# EAGLE design SmartRFv.25.06.15.PS (EAGLE 7.4.0)
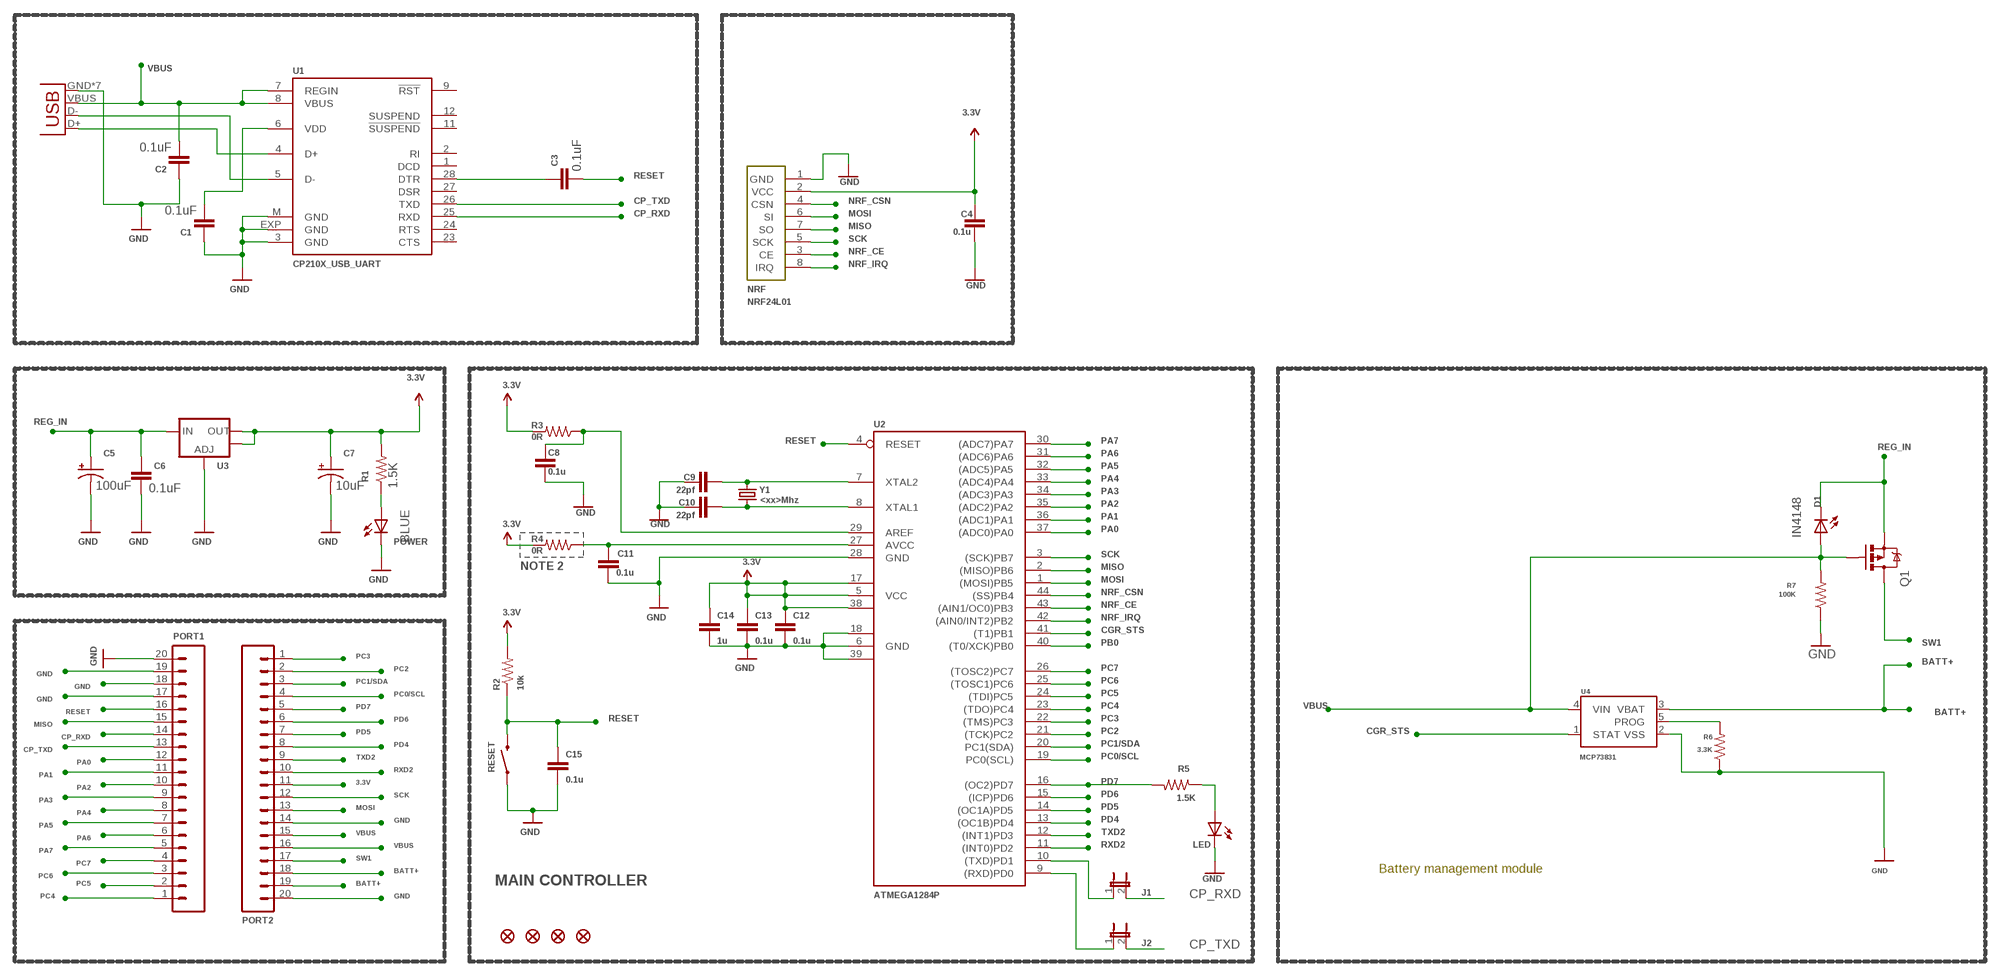
[diagram p0: schematic, sheet 1]

## Parts
C1  0.1uF  CAP0805  [0805]
C2  0.1uF  CAP0805  [0805]
C3  0.1uF  CAP0805  [0805]
C4  0.1u  CAP0805  [0805]
C5  100uF  CAP_POL1206-KIT  [EIA3216-KIT]
C6  0.1uF  CAP0805  [0805]
C7  10uF  CAP_POL1206-KIT  [EIA3216-KIT]
C8  0.1u  CAP0805  [0805]
C9  22pf  CAP0805  [0805]
C10  22pf  CAP0805  [0805]
C11  0.1u  CAP0805  [0805]
C12  0.1u  CAP0805  [0805]
C13  0.1u  CAP0805  [0805]
C14  1u  CAP0805  [0805]
C15  0.1u  CAP0805  [0805]
D1  IN4148  LED1206  [LED-1206]
FID1  FIDUCIAL1X2  [FIDUCIAL-1X2]
FID2  FIDUCIAL1X2  [FIDUCIAL-1X2]
FID3  FIDUCIAL1X2  [FIDUCIAL-1X2]
FID4  FIDUCIAL1X2  [FIDUCIAL-1X2]
J1  JUMPER-2SMD-NC  [SJ_2S]
J2  JUMPER-2SMD-NC  [SJ_2S]
LED  LED  [LED-0805]
NRF  NRF2401  [NRF2401]
PORT1  M20  [1X20]
PORT2  M20  [1X20]
POWER  BLUE  LED  [LED-0805]
Q1  MOSFET-PCHANNELSMD  [SOT23-3]
R1  1.5K  RESISTOR0805-RES  [0805]
R2  10k  RESISTOR0805-RES  [0805]
R3  0R  RESISTOR0805-RES  [0805]
R4  0R  RESISTOR0805-RES  [0805]
R5  1.5K  RESISTOR0805-RES  [0805]
R6  3.3K  RESISTOR0805-RES  [0805]
R7  100K  RESISTOR0805-RES  [0805]
RESET  SWITCH-MOMENTARY-2-SMD-1101NE  [TACTILE-SWITCH-1101NE]
U1  CP210X_USB_UART  [MLP28]
U2  MEGA32-A  [TQFP44]
U3  V_REG_LM1117SOT223  [SOT223]
U4  MCP73831  [SOT23-5]
USB  USB-MICROB  [USB-MICROB]
Y1  <xx>Mhz  CRYSTAL5X3  [CRYSTAL-SMD-5X3]

## Nets
3.3V: C4.2 C7.A(+) C12.1 C13.1 C14.1 NRF.2(VCC) PORT2.11 R1.2 R2.2 R3.2 R4.2 U2.5(VCC) U2.17(VCC1) U2.38(VCC2) U3.2(OUT) U3.4(OUT)
BATT+: PORT2.18 PORT2.19 U4.3(VBAT)
CGR_STS: U2.41((T1)PB1) U4.1(STAT)
CP_RXD: J1.2 PORT1.14 U1.25(RXD)
CP_TXD: J2.2 PORT1.13 U1.26(TXD)
GND: C1.1 C2.1 C4.1 C5.C(-) C6.2 C7.C(-) C8.2 C9.1 C10.1 C11.2 C12.2 C13.2 C14.2 C15.2 LED.2(C) NRF.1(GND) PORT1.17 PORT1.18 PORT1.19 PORT1.20 PORT2.14 PORT2.20 POWER.2(C) R6.1 R7.1 RESET.P$1 U1.3(GND) U1.EXP(GND) U1.M(GND) U2.6(GND) U2.18(GND1) U2.28(GND) U2.39(GND2) U3.1(ADJ) U4.2(VSS) USB.GND USB.MT1(GND) USB.MT2(GND) USB.MT3(GND) USB.MT4(GND) USB.P$1(GND) USB.P$2(GND)
MISO: NRF.7(SO) PORT1.15 U2.2((MISO)PB6)
MOSI: NRF.6(SI) PORT2.13 U2.1((MOSI)PB5)
N$1: C9.2 U2.7(XTAL2) Y1.3
N$2: C10.2 U2.8(XTAL1) Y1.1
N$3: J1.1 U2.10((TXD)PD1)
N$4: C11.1 R4.1 U2.27(AVCC)
N$5: U1.5(D-) USB.D-
N$6: C3.1 U1.28(DTR)
N$7: POWER.1(A) R1.1
N$8: U1.4(D+) USB.D+
N$9: J2.1 U2.9((RXD)PD0)
N$12: C8.1 R3.1 U2.29(AREF)
N$13: LED.1(A) R5.1
N$15: R6.2 U4.5(PROG)
NRF_CE: NRF.3(CE) U2.43((AIN1/OC0)PB3)
NRF_CSN: NRF.4(CSN) U2.44((SS)PB4)
NRF_IRQ: NRF.8(IRQ) U2.42((AIN0/INT2)PB2)
PA0: PORT1.12 U2.37((ADC0)PA0)
PA1: PORT1.11 U2.36((ADC1)PA1)
PA2: PORT1.10 U2.35((ADC2)PA2)
PA3: PORT1.9 U2.34((ADC3)PA3)
PA4: PORT1.8 U2.33((ADC4)PA4)
PA5: PORT1.7 U2.32((ADC5)PA5)
PA6: PORT1.6 U2.31((ADC6)PA6)
PA7: PORT1.5 U2.30((ADC7)PA7)
PB0: U2.40((T0/XCK)PB0)
PC0/SCL: PORT2.4 U2.19(PC0(SCL))
PC1/SDA: PORT2.3 U2.20(PC1(SDA))
PC2: PORT2.2 U2.21((TCK)PC2)
PC3: PORT2.1 U2.22((TMS)PC3)
PC4: PORT1.1 U2.23((TDO)PC4)
PC5: PORT1.2 U2.24((TDI)PC5)
PC6: PORT1.3 U2.25((TOSC1)PC6)
PC7: PORT1.4 U2.26((TOSC2)PC7)
PD4: PORT2.8 U2.13((OC1B)PD4)
PD5: PORT2.7 U2.14((OC1A)PD5)
PD6: PORT2.6 U2.15((ICP)PD6)
PD7: PORT2.5 R5.2 U2.16((OC2)PD7)
REG_IN: C5.A(+) C6.1 D1.C Q1.2(S) U3.3(IN)
RESET: C3.2 C15.1 PORT1.16 R2.1 RESET.P$2 U2.4(RESET)
RXD2: PORT2.10 U2.11((INT0)PD2)
SCK: NRF.5(SCK) PORT2.12 U2.3((SCK)PB7)
SW1: PORT2.17 Q1.3(D)
TXD2: PORT2.9 U2.12((INT1)PD3)
VBUS: C2.2 D1.A PORT2.15 PORT2.16 Q1.1(G) R7.2 U1.7(REGIN) U1.8(VBUS) U4.4(VIN) USB.VBUS
VDD: C1.2 U1.6(VDD)
Unconnected: U1.1(DCD) U1.2(RI) U1.9(!RST) U1.11(!SUSPEND) U1.12(SUSPEND) U1.23(CTS) U1.24(RTS) U1.27(DSR)

## Notes on the sheet
- NOTE 2
- Battery management module
- MAIN CONTROLLER

## Library data of the parts
C1-C3 C6 = SparkFun-Passives:CAP: Capacitor Standard 0603 ceramic capacitor, and 0.1" leaded capacitor.
C4 C8-C15 = SparkFun-Capacitors:CAP: Capacitor Standard 0603 ceramic capacitor, and 0.1" leaded capacitor.
C5 C7 = SparkFun-Passives:CAP_POL: Capacitor Polarized These are standard SMD and PTH capacitors. Normally 10uF, 47uF, and 100uF in electrolytic and tantalum varieties. Always verify the external diameter of the through hole cap, it varies with capacity, voltage, and manufacturer. The EIA devices should be standard.
D1 LED POWER = SparkFun-LED:LED: LEDs Standard schematic elements and footprints for 5mm, 3mm, 1206, and 0603 sized LEDs. 5mm - Spark Fun Electronics SKU : COM-00529 (and others)
FID1-FID4 = SparkFun-Aesthetics:FIDUCIAL: Fiducial Alignment Points Various fiducial points for machine vision alignment.
J1 J2 = SparkFun-Passives:JUMPER-2: Jumper Basic 0.1" spaced jumper. Use with breakaway headers.
NRF = LIBR:NRF2401; MFR_PN: NRF24L01
PORT1 PORT2 = SparkFun-Connectors:M20: 1x20 .1" header This is just like the LOCK variant in that the holes are staggared by 5 mil, but except for the last two holes. They are not altered from the "standard" footprint layout. This is used for a special purpose on the layout of our Graphic LCD Backpack. Make sure you want to use this device before selecting it for you project!
Q1 = SparkFun-DiscreteSemi:MOSFET-PCHANNEL: Generic PMOSFET
R1-R7 = SparkFun-Resistors:RESISTOR: Resistor Basic schematic elements and footprints for 0603, 1206, and PTH resistors.
RESET = SparkFun-Electromechanical:SWITCH-MOMENTARY-2: Various NO switches- pushbuttons, reed, etc
U1 = SparkFun-DigitalIC:CP210X_USB_UART: Single-Chip USB to UART Bridge Source: www.silabs.com .. CP2101.pdf / cp2102.pdf. Spark Fun Electronics SKU : COM-00310
U2 = atmel:MEGA32: MICROCONTROLLER 32 Kbytes FLASH 2 Kbytes SRAM 1 Kbytes EEPROM USART 8-channel 10 bit ADC Source: www.atmel.com .. doc2503.pdf; MPN: ATMEGA1284P; OC_FARNELL: 9171274; OC_NEWARK: 69K6677
U3 = SparkFun-PowerIC:V_REG_LM1117: Voltage Regulator LM1117 Standard adjustable voltage regulator but in SMD form. Spark Fun Electronics SKU : COM-00595
U4 = SparkFun-PowerIC:MCP73831: Miniature single cell, fully integrated Li-Ion, Li-polymer charge management controller http://ww1.microchip.com/downloads/en/DeviceDoc/21984a.pdf IC-09995; PROD_ID: IC-09995
USB = SparkFun-Connectors:USB: USB Connectors USB-B-PTH is fully proven SKU : PRT-00139/CONN-08278 USB-miniB is fully proven SKU : PRT-00587 USB-A-PCB is untested. USB-A-H is throughly reviewed, but untested. Spark Fun Electronics SKU : PRT-00437 USB-B-SMT is throughly reviewed, but untested. Needs silkscreen touching up. USB-A-S has not been used/tested USB-MB-H has not been used/tested USB-MICROB has been used. CONN-09505; PROD_ID: CONN-09505
Y1 = SparkFun-FreqCtrl:CRYSTAL: Various standard crystals. Proven footprints. Spark Fun Electronics SKU : COM-00534

## Board
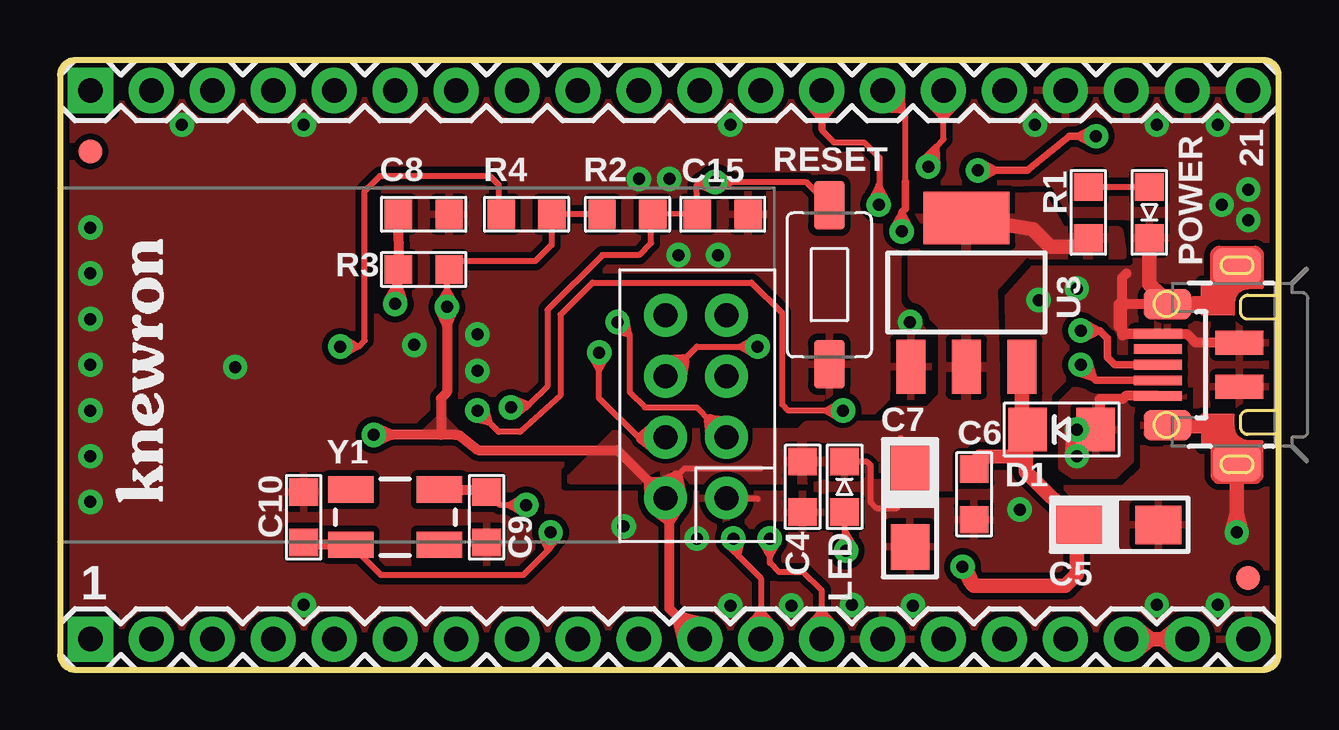
[diagram p1: board, top side]
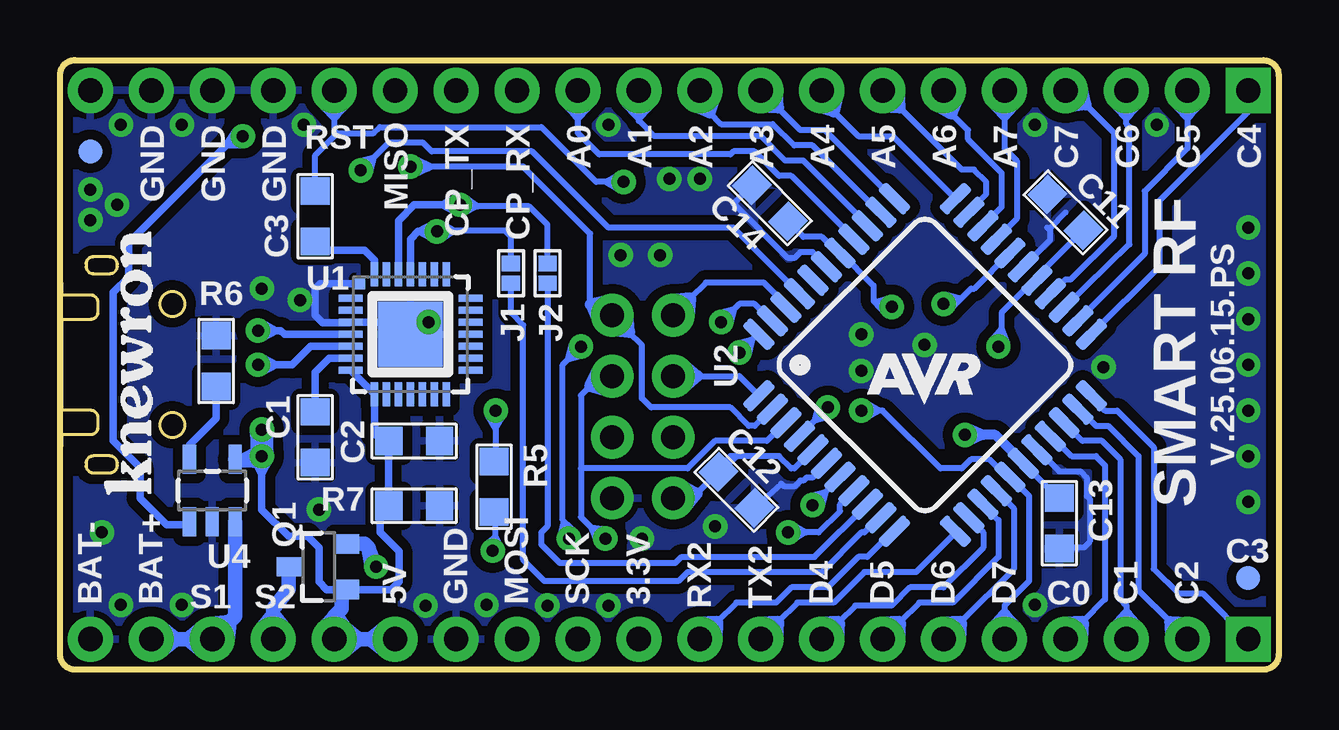
[diagram p2: board, bottom side, seen from below]

Size 50.8 x 25.4 mm. Coordinates in mm from the lower left corner, seen from the top.
Outline: 50.8,0.64 50.8,24.77 arc90 50.16,25.4 0.64,25.39 arc90 0,24.75 0,0.64 arc90 0.64,0 50.16,0 arc90 50.8,0.64
Copper layers (1*16): Top 0.035mm / dielectric 1.5mm / Bottom 0.035mm
Design rules "default *": minimum track width 10mil, minimum drill 18mil, track to track 8mil, track to pad 8mil, pad to pad 0.05mm, via to via 8mil, smd to smd 0mil, copper to edge 5mil, drill to drill 20mil, minimum pad ring 10mil, minimum via ring 8mil, stop-mask expansion 4mil, vias tented up to drill 20mil, thermal gap 10mil

### Footprints (pad centres in the part's own frame; a part is rotated, then mirrored left to right if it is on the bottom)
0805 = smd 1.143 x 1.2: 1 -1.059,0; 2 1.059,0
EIA3216-KIT = smd 1.9 x 1.6: A 1.65,0; C -1.65,0
LED-1206 = smd 1.6 x 1.8: A -1.421,0; C 1.421,0
FIDUCIAL-1X2 = smd 1 x 1: 1 0,0
SJ_2S = smd 0.635 x 0.762: 1 -0.412,0; 2 0.412,0
LED-0805 = smd 1.143 x 1.2: 1 -1.059,0; 2 1.059,0
NRF2401 = drill 1 pad 1.778: 1 0,0; 2 -2.54,0; 3 0,2.54; 4 -2.54,2.54; 5 0,5.08; 6 -2.54,5.08; 7 0,7.62; 8 -2.54,7.62
1X20 = drill 1.016 pad 1.88 square: 1 0,0 | drill 1.016 pad 1.88: 2 2.54,0; 3 5.08,0; 4 7.62,0; 5 10.16,0; 6 12.7,0; 7 15.24,0; 8 17.78,0; 9 20.32,0; 10 22.86,0; 11 25.4,0; 12 27.94,0; 13 30.48,0; 14 33.02,0; 15 35.56,0; 16 38.1,0; 17 40.64,0; 18 43.18,0; 19 45.72,0; 20 48.26,0
SOT23-3 = smd 0.8 x 1.016: 1 -0.95,-1.159; 2 0.95,-1.159; 3 0,1.259
TACTILE-SWITCH-1101NE = smd 2.032 x 1.27: P$1 -3.309,0; P$2 3.309,0
MLP28 = smd 1 x 0.3: 1 -2.5,1.5; 2 -2.5,1; 3 -2.5,0.5; 4 -2.5,0; 5 -2.5,-0.5; 6 -2.5,-1; 7 -2.5,-1.5; 15 2.5,-1.5; 16 2.5,-1; 17 2.5,-0.5; 18 2.5,0; 19 2.5,0.5; 20 2.5,1; 21 2.5,1.5 | smd 0.3 x 1: 8 -1.5,-2.5; 9 -1,-2.5; 10 -0.5,-2.5; 11 0,-2.5; 12 0.5,-2.5; 13 1,-2.5; 14 1.5,-2.5; 22 1.5,2.5; 23 1,2.5; 24 0.5,2.5; 25 0,2.5; 26 -0.5,2.5; 27 -1,2.5; 28 -1.5,2.5 | smd 2.7 x 2.7: EXP 0,0 | smd 0.435 x 0.435: M -2.103,2.103
TQFP44 = smd 1.5 x 0.5: 1 -5.8,4; 2 -5.8,3.2; 3 -5.8,2.4; 4 -5.8,1.6; 5 -5.8,0.8; 6 -5.8,0; 7 -5.8,-0.8; 8 -5.8,-1.6; 9 -5.8,-2.4; 10 -5.8,-3.2; 11 -5.8,-4; 23 5.8,-4; 24 5.8,-3.2; 25 5.8,-2.4; 26 5.8,-1.6; 27 5.8,-0.8; 28 5.8,0; 29 5.8,0.8; 30 5.8,1.6; 31 5.8,2.4; 32 5.8,3.2; 33 5.8,4 | smd 0.5 x 1.5: 12 -4,-5.8; 13 -3.2,-5.8; 14 -2.4,-5.8; 15 -1.6,-5.8; 16 -0.8,-5.8; 17 0,-5.8; 18 0.8,-5.8; 19 1.6,-5.8; 20 2.4,-5.8; 21 3.2,-5.8; 22 4,-5.8; 34 4,5.8; 35 3.2,5.8; 36 2.4,5.8; 37 1.6,5.8; 38 0.8,5.8; 39 0,5.8; 40 -0.8,5.8; 41 -1.6,5.8; 42 -2.4,5.8; 43 -3.2,5.8; 44 -4,5.8
SOT223 = smd 1.219 x 2.235: 1 -2.311,-3.099; 2 0,-3.099; 3 2.311,-3.099 | smd 3.6 x 2.2: 4 0,3.099
SOT23-5 = smd 0.55 x 1.2: 1 -0.95,-1.3; 2 0,-1.3; 3 0.95,-1.3; 4 0.95,1.3; 5 -0.95,1.3
USB-MICROB = smd 0.4 x 2: D+ 0,3.45; D- -0.65,3.45; GND 1.3,3.45; ID 0.65,3.45; VBUS -1.3,3.45 | smd 1.5 x 2: MT1 -4.1,0.15; MT2 4.1,0.15 | smd 1.27 x 1.981: MT3 -2.521,3.05; MT4 2.521,3.05 | smd 1 x 2: P$1 -0.92,0.05; P$2 0.92,0.05
CRYSTAL-SMD-5X3 = smd 1.9 x 1.1: 1 -1.85,-1.15; 2 1.85,-1.15; 3 1.85,1.15; 4 -1.85,1.15

### Placement (x,y rotation side)
C1  40.16,9.68 90 bottom
C2  36.04,9.53 180 bottom
C3  40.16,18.89 90 bottom
C4  30.96,7.62 90 top
C5  44.13,6.03 180 top
C6  38.1,7.3 270 top
C7  35.43,6.76 90 top
C8  15.16,18.97 0 top
C9  17.78,6.35 90 top
C10  10.16,6.35 270 top
C11  8.89,19.05 135 bottom
C12  22.61,7.49 315 bottom
C13  9.14,6.1 270 bottom
C14  21.21,19.43 135 bottom
C15  27.62,18.97 0 top
D1  41.75,10 180 top
FID1  49.53,3.81 0 top
FID2  1.27,21.59 90 top
FID3  49.53,21.59 90 bottom
FID4  1.27,3.81 90 bottom
J1  32,16.51 90 bottom
J2  30.48,16.51 90 bottom
LED  32.7,7.62 90 top
NRF  27.78,7.14 0 top
PORT1  1.27,24.13 0 top
PORT2  1.27,1.27 0 top
POWER  45.4,19.05 270 top
Q1  40.01,4.29 90 bottom
R1  42.86,19.05 270 top
R2  23.65,18.97 180 top
R3  15.16,16.67 0 top
R4  19.45,18.97 0 top
R5  32.7,7.62 90 bottom
R6  44.29,12.86 270 bottom
R7  36.04,6.83 180 bottom
RESET  32.07,16.03 90 top
U1  36.2,13.97 0 bottom
U2  14.74,12.69 45 bottom
U3  37.78,15.72 0 top
U4  44.45,7.46 0 bottom
U$1  [KNEWRON-NAME3]  4.29,6.99 90 top
U$2  [KNEWRON-NAME3]  46.99,7.3 90 bottom
U$3  [AVR-SYMBOL]  17.3,10.95 0 bottom
USB  49.21,12.7 90 top
Y1  13.97,6.35 0 top

### Tracks (layer width: path | path; a pad name or v marks a point on that pad's centre or on a via)
3.3V  (via drill 0.5 pad 1.02)
  Top 0.254: NRF.2 25.24,7.59 25.69,8.04 26.04,8.38 29.21,8.38 | 35.05,9.65 35.05,8.3 C7.A | v16.13,15.11 16.13,15.86 | 16.13,15.86 | 16.13,15.86 16.13,16.63 R3.2 16.52,17.02 19.81,17.02 20.49,17.7 R4.2 R2.2 | 16.13,15.86 | 16.13,15.86 15.8,15.31 | v16.13,15.11 15.8,15.31 | 16.13,15.86 16.46,15.31 | v16.13,15.11 16.46,15.31 | 16.13,15.86 15.8,15.31 | 16.13,15.86 16.46,15.31 | 16.13,15.86 15.8,15.31 | v16.13,15.11 15.8,15.31 | 16.13,15.86 16.46,15.31 | v16.13,15.11 16.46,15.31
  Top 0.406: PORT2.11 25.95,1.99 25.4,2.54 25.4,6.16 | 25.4,6.16 25.4,6.99 NRF.2 | v16.13,15.11 16.13,14.36 | 16.13,14.36 16.13,11.56 15.88,11.3 15.88,9.78 | 24.53,7.85 23.24,9.14 17.43,9.14 16.67,9.75 16.48,9.78 15.88,9.78 | 24.53,7.85 NRF.2 | 15.88,9.78 13.83,9.78 | 13.83,9.78 v13.08,9.78 | 16.13,14.36 16.41,14.99 | v16.13,15.11 16.41,14.99 | 16.13,14.36 15.85,14.99 | v16.13,15.11 15.85,14.99 | 16.13,14.36 16.41,14.99 | 16.13,14.36 15.85,14.99 | 16.13,14.36 16.41,14.99 | v16.13,15.11 16.41,14.99 | 16.13,14.36 15.85,14.99 | v16.13,15.11 15.85,14.99 | 13.83,9.78 13.21,10.06 | v13.08,9.78 13.21,10.06 | 13.83,9.78 13.21,9.5 | v13.08,9.78 13.21,9.5 | 13.83,9.78 13.21,10.06 | 13.83,9.78 13.21,9.5 | 13.83,9.78 13.21,10.06 | v13.08,9.78 13.21,10.06 | 13.83,9.78 13.21,9.5 | v13.08,9.78 13.21,9.5 | 25.4,6.16 25.81,6.76 NRF.2 | 25.4,6.16 24.82,6.6 NRF.2 | 24.53,7.85 24.56,7.12 NRF.2 | 24.53,7.85 25.26,7.83 NRF.2
  Top 0.508: 25.69,8.04 24.98,7.72 NRF.2 25.86,7.28 25.69,8.04
  Top 0.61: U3.4 40.56,18.34 41.27,17.62 42.83,17.62 R1.2
  Top 0.813: 25.95,1.99 26.15,1.15 PORT2.11 26.79,1.79 25.95,1.99
  Bottom 0.254: U2.5 20.19,8.38 20.32,8.38 20.83,8.89 22.58,8.89 | C13.1 9.21,7.16 U2.17 | C14.1 19.81,18.03 19.05,18.03 18.38,17.36 U2.38 18.25,17.36 16.89,16 16.89,15.37 16.85,15.32 | 16.85,15.32 16.64,15.11 v16.13,15.11 | 22.58,8.89 C12.1 23.38,8.24 | 22.58,8.89 22.86,8.89 23.24,8.51 23.24,8.38 23.5,8.13 23.5,8.1 24.26,7.33 24.45,7.14 NRF.2 | 16.85,15.32 | 16.85,15.32 16.22,15.48 | v16.13,15.11 16.22,15.48 | 16.85,15.32 | 16.85,15.32 16.41,14.85 | v16.13,15.11 16.41,14.85 | 16.85,15.32 16.22,15.48 | 16.22,15.48 | v16.13,15.11 16.22,15.48 | 16.85,15.32 16.41,14.85 | v16.13,15.11 16.41,14.85 | 16.85,15.32 16.22,15.48 | v16.13,15.11 16.22,15.48 | 16.85,15.32 16.41,14.85 | v16.13,15.11 16.41,14.85
  Bottom 0.406: U2.17 10.64,8.61 11.81,9.78 12.33,9.78 | 12.33,9.78 v13.08,9.78 | 12.33,9.78 12.96,9.5 | v13.08,9.78 12.96,9.5 | 12.33,9.78 12.96,10.06 | v13.08,9.78 12.96,10.06 | 12.33,9.78 12.96,9.5 | 12.33,9.78 12.96,10.06 | 12.33,9.78 12.96,9.5 | v13.08,9.78 12.96,9.5 | 12.33,9.78 12.96,10.06 | v13.08,9.78 12.96,10.06
  Bottom 0.508: 24.26,7.33 24.75,6.74 NRF.2 24.94,7.7 24.26,7.33
  pour Top (isolate 0.305): 35.56,19.68 40.32,19.68 40.16,19.53 40.32,17.46 38.89,15.88 39.05,8.89 37.78,7.62 34.92,7.62 34.29,8.26 34.29,10.16 34.92,10.79 36.2,10.79 36.83,11.43 36.83,14.29 35.56,15.56
  pour Top: 34.29,10.16 31.11,10.16 30.8,9.84 23.18,9.84 21.27,7.94 33.34,7.94 33.66,7.62 34.92,7.62 34.29,8.26
  pour Top: 40.48,17.3 44.29,17.3 44.13,18.26 41.75,18.26 40.96,19.68 40.48,19.68
  pour Top: 15.88,10.48 15.24,9.84 16.51,9.84
BATT+
  Top 0.61: PORT2.18 45.47,1.27 | 45.47,1.27 45.97,1.27 | 45.97,1.27 PORT2.19 | 45.97,1.27 46.59,0.77 PORT2.19 | 45.97,1.27 46.59,1.77 PORT2.19 | 45.47,1.27 44.85,1.77 PORT2.18 | 45.47,1.27 44.85,0.77 PORT2.18
  Bottom 0.61: U4.3 43.5,2.22 43.73,1.99 | 43.73,1.99 PORT2.18 | 44.29,1.27 PORT2.18 | PORT2.18 45.47,1.27 | 45.47,1.27 45.97,1.27 | 45.97,1.27 PORT2.19 | 45.97,1.27 46.59,0.77 PORT2.19 | 45.97,1.27 46.59,1.77 PORT2.19 | 43.73,1.99 43.82,1.2 PORT2.18 | 43.73,1.99 44.52,1.9 PORT2.18 | 45.47,1.27 44.85,1.77 PORT2.18 | 45.47,1.27 44.85,0.77 PORT2.18
CGR_STS  (via drill 0.5 pad 1.02)
  Top 0.305: 42.43,22.23 42.07,22.23 40.32,20.8 39.01,20.8 | 42.43,22.23 v43.18,22.23 | 39.01,20.8 | 39.01,20.8 v38.26,20.8 | 39.01,20.8 38.43,21.11 | 39.01,20.8 38.43,20.48 | 38.43,21.11 | 38.43,20.48 | 42.43,22.23 | 42.43,22.23 43.01,21.91 | 42.43,22.23 43.01,22.54 | 39.01,20.8 38.43,21.11 | 39.01,20.8 | 39.01,20.8 38.43,21.11 | v38.26,20.8 38.43,21.11 | 39.01,20.8 | 39.01,20.8 38.43,20.48 | v38.26,20.8 38.43,20.48 | 39.01,20.8 38.43,21.11 | v38.26,20.8 38.43,21.11 | 39.01,20.8 38.43,20.48 | v38.26,20.8 38.43,20.48 | 42.43,22.23 | 42.43,22.23 | 42.43,22.23 43.01,21.91 | 43.01,21.91 | v43.18,22.23 43.01,21.91 | 42.43,22.23 43.01,22.54 | 43.01,22.54 | v43.18,22.23 43.01,22.54 | 42.43,22.23 43.01,21.91 | 42.43,22.23 43.01,22.54 | 42.43,22.23 43.01,21.91 | v43.18,22.23 43.01,21.91 | 42.43,22.23 43.01,22.54 | v43.18,22.23 43.01,22.54
  Bottom 0.254: U2.41 22.73,18.41 27.94,18.41 31.11,21.59 35.31,21.59 35.69,21.97 37.08,21.97 37.73,21.33 | 37.73,21.33 v38.26,20.8 | 37.73,21.33 37.89,20.7 v38.26,20.8 | 37.73,21.33 38.35,21.16 v38.26,20.8
  Bottom 0.305: v43.18,22.23 43.5,22.23 43.84,21.88 | 43.84,21.88 47.94,17.78 47.94,16.35 48.58,15.72 48.58,9.53 47.47,8.41 47.47,7.14 46.35,6.03 45.53,6.03 U4.1 | 43.84,21.88 43.47,22.42 v43.18,22.23 | 43.84,21.88 43.18,21.87 v43.18,22.23
CP_RXD  (via drill 0.5 pad 1.02)
  Top 0.254: 35.24,20.32 35.24,23.18 35.01,23.41 PORT1.14
  Top 0.305: 35.24,20.32 35.24,19.21 35.08,19.05 35.08,19.01 | 35.08,19.01 v35.08,18.26 | v35.08,18.26 35.4,18.09 | v35.08,18.26 34.77,18.09 | 35.08,19.01 | 35.08,19.01 34.77,18.43 | 35.08,19.01 35.4,18.43 | 35.08,19.01 | 35.08,19.01 | 35.08,19.01 34.77,18.43 | 34.77,18.43 | v35.08,18.26 34.77,18.43 | 35.08,19.01 35.4,18.43 | 35.4,18.43 | v35.08,18.26 35.4,18.43 | 35.08,19.01 34.77,18.43 | 35.08,19.01 35.4,18.43 | 35.08,19.01 34.77,18.43 | v35.08,18.26 34.77,18.43 | 35.08,19.01 35.4,18.43 | v35.08,18.26 35.4,18.43
  Top 0.508: 35.01,23.41 34.98,24.16 PORT1.14 34.26,23.45 35.01,23.41
  Bottom 0.254: J1.2 32,18.03 32.26,18.29 34.33,18.29 | 34.33,18.29 35.05,18.29 v35.08,18.26 | 34.33,18.29 34.88,17.94 v35.08,18.26 | 34.33,18.29 34.9,18.59 v35.08,18.26
  Bottom 0.305: U1.25 36.2,17.94 35.88,18.26 35.83,18.26 | 35.83,18.26 | 35.83,18.26 v35.08,18.26 | 35.83,18.26 35.25,18.57 | 35.83,18.26 35.25,17.94 | 35.25,18.57 | 35.25,17.94 | 35.83,18.26 35.25,18.57 | 35.83,18.26 | 35.83,18.26 35.25,18.57 | v35.08,18.26 35.25,18.57 | 35.83,18.26 | 35.83,18.26 35.25,17.94 | v35.08,18.26 35.25,17.94 | 35.83,18.26 35.25,18.57 | v35.08,18.26 35.25,18.57 | 35.83,18.26 35.25,17.94 | v35.08,18.26 35.25,17.94
CP_TXD  (via drill 0.5 pad 1.02)
  Top 0.254: 31.75,22.54 31.75,22.48 32.26,21.97 33.53,21.97 34.16,21.34 34.16,20.19 34.13,20.16
  Top 0.305: PORT1.13 31.75,23.11 31.75,22.54 | 34.13,20.16 34.13,20.12 | 34.13,20.12 v34.13,19.37 | v34.13,19.37 34.4,19.14 | v34.13,19.37 33.79,19.27 | 34.13,20.12 | 34.13,20.12 33.82,19.54 | 34.13,20.12 34.44,19.54 | 34.13,20.12 | 34.13,20.12 | 34.13,20.12 33.82,19.54 | 33.82,19.54 | v34.13,19.37 33.82,19.54 | 34.13,20.12 34.44,19.54 | 34.44,19.54 | v34.13,19.37 34.44,19.54 | 34.13,20.12 33.82,19.54 | 34.13,20.12 34.44,19.54 | 34.13,20.12 33.82,19.54 | v34.13,19.37 33.82,19.54 | 34.13,20.12 34.44,19.54 | v34.13,19.37 34.44,19.54
  Top 0.61: 31.75,23.11 32.25,23.73 PORT1.13 31.25,23.73 31.75,23.11
  Bottom 0.254: J2.2 30.48,18.54 31.24,19.3 33.38,19.3 | 33.38,19.3 34.07,19.3 v34.13,19.37 | 33.38,19.3 33.97,19.02 v34.13,19.37 | 33.38,19.3 33.91,19.68 v34.13,19.37
  Bottom 0.305: U1.26 36.7,18.71 36.04,19.37 34.88,19.37 | v34.13,19.37 34.88,19.37 | 34.88,19.37 | 34.88,19.37 34.3,19.68 | 34.88,19.37 34.3,19.05 | 34.3,19.68 | 34.3,19.05 | 34.88,19.37 34.3,19.68 | 34.88,19.37 | 34.88,19.37 34.3,19.68 | v34.13,19.37 34.3,19.68 | 34.88,19.37 | 34.88,19.37 34.3,19.05 | v34.13,19.37 34.3,19.05 | 34.88,19.37 34.3,19.68 | v34.13,19.37 34.3,19.68 | 34.88,19.37 34.3,19.05 | v34.13,19.37 34.3,19.05
GND  (via drill 0.5 pad 1.02)
  Top 0.254: 29.08,7.11 27.81,7.11 NRF.1 | LED.2 33.61,8.68 33.78,8.51 33.78,6.99 34.04,6.73 34.88,6.73 R7.1
  Top 0.406: USB.GND 44.42,14 44.13,14.29 44.13,15.24 45.4,15.24 45.81,15.65 | USB.P$2 47.34,13.62 46.99,13.97 44.34,13.97 R6.1 44.29,16.35 44.45,16.51
  Top 0.61: USB.MT2 48.9,16.63 48.9,15.88 48.32,15.3 USB.MT4 45.81,15.65 45.4,16.06 POWER.2 | v49.05,5.71 49.05,6.46 | 49.05,6.46 | 49.05,6.46 USB.MT1 48.42,9.24 48.42,9.84 48.16,10.1 USB.MT3 | 49.05,6.46 49.25,5.77 | 48.86,5.77 | 48.86,5.77 | 49.05,6.46 48.86,5.77 | 48.86,5.77 | v49.05,5.71 48.86,5.77 | 49.05,6.46 49.25,5.77 | 49.25,5.77 | 49.25,5.77 | 49.05,6.46 49.25,5.77 | 49.05,6.46 48.86,5.77 | 48.86,5.77 | 49.05,6.46 | 49.05,6.46 48.86,5.77 | 48.86,5.77 | v49.05,5.71 48.86,5.77 | 49.05,6.46 49.25,5.77 | 49.25,5.77 | v49.05,5.71 49.25,5.77 | 49.05,6.46 48.86,5.77 | v49.05,5.71 48.86,5.77 | 49.05,6.46 49.25,5.77 | 49.25,5.77 | 49.05,6.46 48.86,5.77 | v49.05,5.71 48.86,5.77 | 49.05,6.46 49.25,5.77 | v49.05,5.71 49.25,5.77
  Bottom 0.254: U2.18 10.04,9.16 9.14,8.26 8.26,8.26 8,8 8,7.24 7.87,7.11 7.87,5.33 8.13,5.08 9.1,5.08 C13.2 | 8.89,19.05 | C12.2 20.73,7.75 20.6,7.62 20.19,7.62 19.94,7.87 19.81,7.87 19.68,8 19.43,8 U2.6 | U2.28 9.53,17.91 9.53,18.29 9.65,18.41 9.53,18.41 8.89,19.05 | U2.39 18.85,16.81 19.43,17.4 19.94,17.4 20.19,17.14 20.45,17.14 22.73,19.43 22.71,19.43 C14.2
  Bottom 0.305: 36.83,13.97 37.33,14.47 U1.3 38.72,14.45 39.85,14.45 40.16,14.76 40.16,15.88 39.97,16.07 U1.M
  other vias: 33.02,2.7 49.53,20 49.53,18.73 40.64,22.7 48.42,19.37 40.8,15.4 42.39,15.88 45.72,22.7 48.26,22.7 40.01,6.67 45.72,2.7 48.26,2.7 10.16,22.7 10.16,2.7 14.76,13.53 17.4,13.97 17.4,12.45 24.13,20.45 25.4,20.45 35.43,14.48 25.78,17.27 27.43,17.27 27.94,2.67 23.5,5.97 26.54,5.46 1.27,8.89 1.27,10.79 1.27,12.7 1.27,14.61 1.27,6.99 1.27,16.51 1.27,18.41 30.48,2.67 35.56,2.67 5.08,22.7 27.94,22.7 7.3,12.6
  pour Bottom (isolate 0.406, rank 3): -1.91,27.3 52.07,27.3 52.07,-1.27 -1.91,-1.27
  pour Top (isolate 0.254, rank 3): -1.27,26.35 51.44,26.35 51.44,-0.32 -1.27,-0.32
MISO  (via drill 0.5 pad 1.02)
  Top 0.254: 36.41,21.68 36.2,21.46 v36.2,20.95 | 36.41,21.68 36.52,21.79 | 36.52,21.79 36.83,22.1 36.83,23.11 PORT1.15 | 36.52,21.79 36.4,21.68 | 36.4,21.68 35.93,21.23 | v36.2,20.95 35.93,21.23 | 36.52,21.79 36.58,20.98 | 36.41,21.68 35.94,21.23 v36.2,20.95 | 36.41,21.68 36.56,21.05 v36.2,20.95 | 36.4,21.68 35.93,21.23 | v36.2,20.95 35.93,21.23 | 36.4,21.68 36.56,21.05 v36.2,20.95 | v36.2,20.95 35.99,21.28 36.53,21.62 36.58,20.98 | v36.2,20.95 36.58,20.98
  Top 0.508: 36.83,23.11 37.34,23.67 PORT1.15 36.32,23.67 36.83,23.11
  Bottom 0.254: U2.2 21.15,10.85 21.84,10.16 22.1,10.16 22.86,10.92 26.16,10.92 26.54,11.3 26.54,13.53 27.07,14.06 NRF.7 28.23,14.76 28.68,15.21 28.7,15.24 28.7,18.16 31.5,20.95 35.3,20.95 | 35.3,20.95 35.45,20.95 | 35.45,20.95 v36.2,20.95 | 35.3,20.95 36.03,20.61 | v36.2,20.95 36.03,20.61 | 35.3,20.95 36.03,21.3 | v36.2,20.95 36.03,21.3 | 35.45,20.95 36,20.63 v36.2,20.95 | 35.45,20.95 36,21.28 v36.2,20.95 | 36.03,20.61 35.45,20.88 35.97,21.26 v36.2,20.95 | v36.2,20.95 36.03,20.61 | v36.2,20.95 35.97,20.65 35.45,21.03 36.03,21.3 | v36.2,20.95 36.03,21.3
  Bottom 0.508: NRF.7 27.84,14.13 27.07,14.06 27.15,14.82 NRF.7 | NRF.7 27.92,15.38 28.68,15.21 28.36,14.51 NRF.7
MOSI  (via drill 0.5 pad 1.02)
  Top 0.254: PORT2.13 31.75,2.29 31.75,3.3 30.99,4.06 29.97,4.06 29.59,4.45 29.59,4.71 | 29.59,4.71 v29.59,5.46 | NRF.6 25.3,12.22 25.98,12.9 26.54,13.46 28.33,13.46 | 28.33,13.46 | 28.33,13.46 v29.08,13.46 | 29.59,4.71 29.89,5.32 v29.59,5.46 | 29.59,4.71 | 29.59,4.71 29.3,5.32 v29.59,5.46 | 28.33,13.46 | 28.33,13.46 28.89,13.13 | v29.08,13.46 28.89,13.13 | 28.33,13.46 28.89,13.79 | v29.08,13.46 28.89,13.79 | 28.33,13.46 28.89,13.13 | 28.33,13.46 28.89,13.79 | 28.33,13.46 28.89,13.13 | v29.08,13.46 28.89,13.13 | 28.33,13.46 28.89,13.79 | v29.08,13.46 28.89,13.79 | 29.59,4.71 29.92,5.27 | v29.59,5.46 29.92,5.27 | 29.59,4.71 | 29.59,4.71 29.26,5.27 | v29.59,5.46 29.26,5.27 | 29.59,4.71 29.92,5.27 | 29.59,4.71 29.26,5.27 | 29.59,4.71 29.92,5.27 | v29.59,5.46 29.92,5.27 | 29.59,4.71 29.26,5.27 | v29.59,5.46 29.26,5.27
  Top 0.508: 25.98,12.9 25.21,12.86 NRF.6 25.87,12.13 25.98,12.9 | 31.75,2.29 31.24,1.73 PORT2.13 32.26,1.73 31.75,2.29
  Bottom 0.254: NRF.6 24.24,12.22 22.48,12.22 U2.1 | 29.61,12.93 29.84,12.7 29.84,6.22 29.8,6.18 | 29.61,12.93 v29.08,13.46 | v29.59,5.46 29.59,5.97 29.8,6.18 | 29.8,6.18 29.35,5.68 v29.59,5.46 | 29.8,6.18 29.91,5.51 v29.59,5.46 | 29.61,12.93 29.45,13.56 v29.08,13.46 | 29.61,12.93 28.99,13.09 v29.08,13.46 | 29.8,6.18 29.33,5.74 | v29.59,5.46 29.33,5.74 | 29.8,6.18 | 29.8,6.18 29.96,5.55 | v29.59,5.46 29.96,5.55 | 29.8,6.18 29.33,5.74 | v29.59,5.46 29.33,5.74 | 29.8,6.18 29.96,5.55 | v29.59,5.46 29.96,5.55
  Bottom 0.508: 24.24,12.22 24.84,11.73 NRF.6 24.84,12.71 24.24,12.22
N$1  (via drill 0.5 pad 1.02)
  Top 0.254: v19.43,6.86 18.68,6.86 | 18.68,6.86 | 18.68,6.86 18.33,6.86 C9.2 | 18.68,6.86 | 18.68,6.86 19.24,6.53 | v19.43,6.86 19.24,6.53 | 18.68,6.86 19.24,7.19 | v19.43,6.86 19.24,7.19 | 18.68,6.86 19.24,6.53 | 18.68,6.86 19.24,7.19 | 18.68,6.86 19.24,6.53 | v19.43,6.86 19.24,6.53 | 18.68,6.86 19.24,7.19 | v19.43,6.86 19.24,7.19
  Top 0.406: Y1.3 17.78,7.5 C9.2
  Bottom 0.254: U2.7 18.28,8.01 18.9,7.39 | 18.9,7.39 v19.43,6.86 | 18.9,7.39 19.06,6.76 v19.43,6.86 | 18.9,7.39 19.53,7.23 v19.43,6.86
N$2  (via drill 0.5 pad 1.02)
  Top 0.254: 20.34,4.97 20.45,5.08 v20.45,5.71 | 20.34,4.97 19.3,3.94 13.38,3.94 Y1.1 | 20.34,4.97 20.74,5.48 v20.45,5.71 | 20.34,4.97 20.09,5.57 v20.45,5.71
  Top 0.406: Y1.1 10.16,5.2 C10.2
  Bottom 0.254: 17.71,7.43 U2.8 18.29,6.89 18.29,6.6 19.18,5.71 19.7,5.71 | 19.7,5.71 | 19.7,5.71 v20.45,5.71 | 19.7,5.71 | 19.7,5.71 20.25,5.39 | v20.45,5.71 20.25,5.39 | 19.7,5.71 20.25,6.04 | v20.45,5.71 20.25,6.04 | 19.7,5.71 20.25,5.39 | 19.7,5.71 20.25,6.04 | 19.7,5.71 20.25,5.39 | v20.45,5.71 20.25,5.39 | 19.7,5.71 20.25,6.04 | v20.45,5.71 20.25,6.04
N$3
  Bottom 0.254: U2.10 16.58,6.28 16.71,6.28 17.27,5.71 17.4,5.71 19.05,4.06 24.64,4.06 25.02,3.68 30.61,3.68 31.5,4.57 31.5,14.35 32,14.86 J1.1
N$4  (via drill 0.5 pad 1.02)
  Top 0.254: v11.68,13.46 12.43,13.46 | 12.43,13.46 | 12.43,13.46 12.45,13.46 12.7,13.72 12.7,19.94 13.34,20.57 17.91,20.57 18.29,20.19 18.29,19.04 R4.1 | 12.43,13.46 11.88,13.79 | v11.68,13.46 11.88,13.79 | 12.43,13.46 | 12.43,13.46 11.88,13.13 | v11.68,13.46 11.88,13.13 | 12.43,13.46 11.88,13.79 | 12.43,13.46 11.88,13.13 | 12.43,13.46 11.88,13.79 | v11.68,13.46 11.88,13.79 | 12.43,13.46 11.88,13.13 | v11.68,13.46 11.88,13.13
  Bottom 0.254: U2.27 10.08,16.34 | C11.1 10.08,16.36 10.08,16.34 | 10.08,16.34 11.56,14.86 11.56,14.2 | 11.56,14.2 11.56,13.59 v11.68,13.46 | 11.56,14.2 11.33,13.6 v11.68,13.46 | 11.56,14.2 11.97,13.71 v11.68,13.46
N$5  (via drill 0.5 pad 1.02)
  Top 0.254: 45.75,12.06 USB.D-
  Top 0.305: 45.75,12.06 43.18,12.06 43.08,12.17 | 43.08,12.17 v42.55,12.7 | 43.08,12.17 42.89,12.8 v42.55,12.7 | 43.08,12.17 42.44,12.36 v42.55,12.7
  Bottom 0.305: U1.5 40.35,13.47 41.12,12.7 41.8,12.7 | 41.8,12.7 v42.55,12.7 | 41.8,12.7 | 41.8,12.7 42.38,12.39 | 41.8,12.7 42.38,13.01 | 41.8,12.7 | 41.8,12.7 | 41.8,12.7 42.38,12.39 | 42.38,12.39 | v42.55,12.7 42.38,12.39 | 41.8,12.7 42.38,13.01 | 42.38,13.01 | v42.55,12.7 42.38,13.01 | 41.8,12.7 42.38,12.39 | 41.8,12.7 42.38,13.01 | 41.8,12.7 42.38,12.39 | v42.55,12.7 42.38,12.39 | 41.8,12.7 42.38,13.01 | v42.55,12.7 42.38,13.01
N$6
  Bottom 0.305: U1.28 37.7,17.06 38.1,17.46 40.13,17.46 C3.1
N$7
  Top 0.254: R1.1 POWER.1
N$8  (via drill 0.5 pad 1.02)
  Top 0.305: USB.D+ 43.97,12.7 43.66,13.02 43.66,13.81 43.34,14.13 43.3,14.13 | 43.3,14.13 | 43.3,14.13 v42.55,14.13 | 43.3,14.13 42.71,14.44 | 43.3,14.13 42.71,13.82 | 42.71,14.44 | 42.71,13.82 | 43.3,14.13 42.71,14.44 | 43.3,14.13 | 43.3,14.13 42.71,14.44 | v42.55,14.13 42.71,14.44 | 43.3,14.13 | 43.3,14.13 42.71,13.82 | v42.55,14.13 42.71,13.82 | 43.3,14.13 42.71,14.44 | v42.55,14.13 42.71,14.44 | 43.3,14.13 42.71,13.82 | v42.55,14.13 42.71,13.82
  Bottom 0.305: U1.4 41.43,13.97 41.59,14.13 41.8,14.13 | 41.8,14.13 v42.55,14.13 | 41.8,14.13 | 41.8,14.13 42.38,13.82 | 41.8,14.13 42.38,14.44 | 41.8,14.13 | 41.8,14.13 | 41.8,14.13 42.38,13.82 | 42.38,13.82 | v42.55,14.13 42.38,13.82 | 41.8,14.13 42.38,14.44 | 42.38,14.44 | v42.55,14.13 42.38,14.44 | 41.8,14.13 42.38,13.82 | 41.8,14.13 42.38,14.44 | 41.8,14.13 42.38,13.82 | v42.55,14.13 42.38,13.82 | 41.8,14.13 42.38,14.44 | v42.55,14.13 42.38,14.44
N$9
  Bottom 0.254: J2.1 30.48,5.97 30.73,5.71 30.73,5.21 29.97,4.45 25.15,4.45 24.89,4.7 19.34,4.7 U2.9
N$12  (via drill 0.5 pad 1.02)
  Top 0.406: C8.1 14.12,16.73 R3.1 14.05,15.98 | 14.05,15.98 14.05,15.32 v13.97,15.24 | 14.05,15.98 13.71,15.39 v13.97,15.24 | 14.05,15.98 14.26,15.33 v13.97,15.24
  Bottom 0.254: v13.97,15.24 13.46,15.24 13.25,15.45 | 13.25,15.45 12.83,15.88 12.69,15.88 U2.29 | 13.25,15.45 13.69,14.98 | v13.97,15.24 13.69,14.98 | 13.25,15.45 | 13.25,15.45 13.88,15.61 | v13.97,15.24 13.88,15.61 | 13.25,15.45 13.69,14.98 | v13.97,15.24 13.69,14.98 | 13.25,15.45 13.88,15.61 | v13.97,15.24 13.88,15.61 | 13.25,15.45 13.69,14.98 | v13.97,15.24 13.69,14.98 | 13.25,15.45 13.88,15.61 | v13.97,15.24 13.88,15.61
N$13  (via drill 0.5 pad 1.02)
  Top 0.254: 32.77,5.7 | 32.77,5.7 v32.77,4.95 | 32.77,5.7 | 32.77,5.7 32.44,5.15 | v32.77,4.95 32.44,5.15 | 32.77,5.7 33.09,5.15 | v32.77,4.95 33.09,5.15 | 32.77,5.7 32.44,5.15 | 32.77,5.7 33.09,5.15 | 32.77,5.7 32.44,5.15 | v32.77,4.95 32.44,5.15 | 32.77,5.7 33.09,5.15 | v32.77,4.95 33.09,5.15 | 32.86,5.08 32.7,5.24 LED.1 32.7,5.77 32.77,5.7
  Bottom 0.254: v32.77,4.95 32.77,5.33 32.64,5.46 32.64,5.53 | 32.64,6.43 32.77,6.56 LED.1 arc90 32.64,6.5 32.64,5.53 | 32.64,5.53 32.41,5.09 v32.77,4.95 | 32.64,5.53 33.06,5.2 v32.77,4.95
N$15
  Bottom 0.305: U4.5 45.4,9.37 44.29,10.48 R6.2
NRF_CE  (via drill 0.5 pad 1.02)
  Top 0.254: v23.24,14.48 23.75,13.97 23.75,13.93 | 23.75,13.93 23.75,11.56 24.38,10.92 26.54,10.92 27.07,10.39 NRF.3 | 23.75,13.93 23.61,14.56 v23.24,14.48 | 23.75,13.93 23.13,14.11 v23.24,14.48
  Top 0.508: 27.07,10.39 27.15,9.62 NRF.3 27.84,10.32 27.07,10.39
  Bottom 0.254: U2.43 21.13,14.53 21.84,15.24 22.48,15.24 22.71,15.01 | 22.71,15.01 v23.24,14.48 | 22.71,15.01 22.87,14.38 v23.24,14.48 | 22.71,15.01 23.34,14.85 v23.24,14.48
NRF_CSN  (via drill 0.5 pad 1.02)
  Top 0.254: NRF.4 25.21,9.65 24.24,9.65 24.13,9.65 22.48,11.3 22.48,12.46 | 22.48,12.46 | 22.48,12.46 v22.48,13.21 | 22.48,12.46 22.81,13.01 | v22.48,13.21 22.81,13.01 | 22.48,12.46 | 22.48,12.46 22.15,13.01 | v22.48,13.21 22.15,13.01 | 22.48,12.46 22.81,13.01 | 22.48,12.46 22.15,13.01 | 22.48,12.46 22.81,13.01 | v22.48,13.21 22.81,13.01 | 22.48,12.46 22.15,13.01 | v22.48,13.21 22.15,13.01
  Top 0.508: 24.24,9.65 24.85,9.18 NRF.4 24.82,10.16 24.24,9.65
  Bottom 0.254: U2.44 21.67,13.89 21.8,13.89 21.95,13.74 | 21.95,13.74 v22.48,13.21 | 21.95,13.74 22.11,13.11 v22.48,13.21 | 21.95,13.74 22.57,13.58 v22.48,13.21
NRF_IRQ
  Bottom 0.254: U2.42 20.54,15.21 21.46,16.13 23.88,16.13 24.53,15.47 NRF.8
  Bottom 0.508: 24.53,15.47 24.61,14.7 NRF.8 25.3,15.4 24.53,15.47
PA0
  Bottom 0.254: U2.37 17.71,17.97 20.32,20.57 20.83,20.57 21.84,21.59 22.73,21.59 22.86,21.46 28.32,21.46 29.21,22.35 29.21,23.11 PORT1.12
  Bottom 0.508: 29.21,23.11 29.72,23.67 PORT1.12 28.7,23.67 29.21,23.11
PA1
  Bottom 0.254: U2.36 17.15,18.55 19.81,21.21 20.57,21.21 21.59,22.23 26.04,22.23 26.67,22.86 26.67,23.11 PORT1.11
  Bottom 0.508: 26.67,23.11 27.18,23.67 PORT1.11 26.16,23.67 26.67,23.11
PA2
  Bottom 0.254: U2.35 16.64,19.06 19.43,21.84 20.19,21.84 21.08,22.73 23.24,22.73 23.71,23.2 24.13,23.62 PORT1.10
  Bottom 0.508: 23.71,23.2 24.4,23.5 PORT1.10 23.48,23.92 23.71,23.2
PA3
  Bottom 0.254: U2.34 16.07,19.62 18.92,22.48 19.94,22.48 20.87,23.41 PORT1.9
  Bottom 0.508: 20.87,23.41 21.62,23.45 PORT1.9 20.91,24.16 20.87,23.41
PA4
  Bottom 0.254: PORT1.8 19.05,23.75 18.55,23.25 17.53,22.23 16.07,22.23 U2.33
  Bottom 0.508: 18.55,23.25 19.26,23.48 PORT1.8 18.38,23.98 18.55,23.25
PA5
  Bottom 0.254: U2.32 12.82,19.06 12.82,19.18 12.19,19.81 12.19,20.32 12.7,20.83 13.21,20.83 15.79,23.41 PORT1.7
  Bottom 0.508: 15.79,23.41 16.54,23.45 PORT1.7 15.82,24.16 15.79,23.41
PA6
  Bottom 0.254: PORT1.6 13.97,23.5 13.64,23.17 12.95,22.48 12.95,22.1 11.56,20.7 11.56,19.27 U2.31
  Bottom 0.508: 13.64,23.17 14.3,23.53 PORT1.6 13.34,23.86 13.64,23.17
PA7
  Bottom 0.254: PORT1.5 11.43,23.11 11.43,21.72 10.92,21.21 10.92,18.78 U2.30
  Bottom 0.508: 11.43,23.11 11.94,23.67 PORT1.5 10.92,23.67 11.43,23.11
PC0/SCL
  Bottom 0.254: U2.19 9.47,9.72 8.64,8.89 7.62,8.89 7.24,8.51 7.24,2.92 8.17,1.99 PORT2.4
  Bottom 0.508: 8.17,1.99 8.21,1.24 PORT2.4 8.92,1.96 8.17,1.99
PC1/SDA
  Bottom 0.254: 8.89,10.29 U2.20 8.18,9.53 7.37,9.53 6.6,8.76 6.6,2.92 6.35,2.67 6.35,2.29 PORT2.3
  Bottom 0.508: 6.35,2.29 5.84,1.73 PORT2.3 6.86,1.73 6.35,2.29
PC2
  Bottom 0.254: U2.21 8.31,10.85 7.62,10.16 7.11,10.16 5.84,8.89 5.84,3.3 4.53,1.99 PORT2.2
  Bottom 0.508: 4.53,1.99 3.78,1.96 PORT2.2 4.5,1.24 4.53,1.99
PC3
  Bottom 0.254: U2.22 7.82,11.37 7.24,10.79 6.73,10.79 5.21,9.27 5.21,4.19 4.19,3.17 3.17,3.17 PORT2.1
PC4
  Bottom 0.254: PORT1.1 1.27,23.24 4.99,19.53 4.99,16.8 U2.23
PC5
  Bottom 0.254: PORT1.2 3.81,23.11 3.81,21.72 5.59,19.94 5.59,17.32 U2.24
  Bottom 0.508: 3.81,23.11 4.32,23.67 PORT1.2 3.3,23.67 3.81,23.11
PC6
  Bottom 0.254: U2.25 8.91,15.1 6.22,17.72 6.22,22.61 6.35,22.73 6.35,23.11 PORT1.3
  Bottom 0.508: 6.35,23.11 6.86,23.67 PORT1.3 5.84,23.67 6.35,23.11
PC7
  Bottom 0.254: PORT1.4 8.64,24.13 8.06,23.55 6.86,22.35 6.86,18.07 8.67,16.26 8.89,16.26 9.48,15.66 U2.26
  Bottom 0.508: 8.06,23.55 8.8,23.45 PORT1.4 8.22,24.28 8.06,23.55
PD4
  Bottom 0.254: U2.13 12.91,6.17 12.78,6.17 12.32,5.71 12.32,5.08 13.97,3.43 15.37,3.43 16.13,2.67 17.65,2.67 18.33,1.99 PORT2.8
  Bottom 0.508: 18.33,1.99 18.36,1.24 PORT2.8 19.08,1.96 18.33,1.99
PD5
  Bottom 0.254: U2.14 12.34,6.88 11.68,6.22 11.68,4.7 13.59,2.79 14.99,2.79 15.79,1.99 PORT2.7
  Bottom 0.508: 15.79,1.99 15.82,1.24 PORT2.7 16.54,1.96 15.79,1.99
PD6
  Bottom 0.254: U2.15 11.05,6.73 11.05,4.19 13.25,1.99 PORT2.6
  Bottom 0.508: 13.25,1.99 13.29,1.24 PORT2.6 14,1.96 13.25,1.99
PD7  (via drill 0.5 pad 1.02)
  Top 0.254: v32.64,10.79 31.89,10.79 | 31.89,10.79 | 31.89,10.79 30.35,10.79 30.1,11.05 30.1,14.86 28.83,16.13 22.19,16.13 20.86,14.8 20.86,11.43 19.18,9.91 18.29,9.91 17.93,10.27 | 17.93,10.27 v17.4,10.79 | 17.93,10.27 17.77,10.89 v17.4,10.79 | 17.93,10.27 17.3,10.43 v17.4,10.79 | 31.89,10.79 | 31.89,10.79 32.45,10.47 | v32.64,10.79 32.45,10.47 | 31.89,10.79 32.45,11.12 | v32.64,10.79 32.45,11.12 | 31.89,10.79 32.45,10.47 | 31.89,10.79 32.45,11.12 | 31.89,10.79 32.45,10.47 | v32.64,10.79 32.45,10.47 | 31.89,10.79 32.45,11.12 | v32.64,10.79 32.45,11.12
  Bottom 0.254: PORT2.5 11.43,2.29 11.43,2.67 10.41,3.68 10.41,7.24 U2.16 11.33,8.03 12.06,8.76 12.83,8.76 13.21,8.38 14.1,8.38 16.51,10.79 16.65,10.79 | 32.64,10.04 | 32.64,10.04 v32.64,10.79 | 16.65,10.79 | 16.65,10.79 v17.4,10.79 | 16.65,10.79 | 16.65,10.79 17.2,10.47 | v17.4,10.79 17.2,10.47 | 16.65,10.79 17.2,11.12 | v17.4,10.79 17.2,11.12 | 16.65,10.79 17.2,10.47 | 16.65,10.79 17.2,11.12 | 16.65,10.79 17.2,10.47 | v17.4,10.79 17.2,10.47 | 16.65,10.79 17.2,11.12 | v17.4,10.79 17.2,11.12 | 32.64,10.04 32.97,10.6 | v32.64,10.79 32.97,10.6 | 32.64,10.04 | 32.64,10.04 32.31,10.6 | v32.64,10.79 32.31,10.6 | 32.64,10.04 32.97,10.6 | 32.64,10.04 32.31,10.6 | 32.64,10.04 32.97,10.6 | v32.64,10.79 32.97,10.6 | 32.64,10.04 32.31,10.6 | v32.64,10.79 32.31,10.6 | 32.64,10.04 32.64,8.68 R5.2
  Bottom 0.508: 11.43,2.29 10.92,1.73 PORT2.5 11.94,1.73 11.43,2.29
REG_IN  (via drill 0.5 pad 1.02)
  Top 0.61: U3.3 40.09,10.63 D1.C 40.25,9.05 | 40.22,9.02 40.25,9.05 | 42.7,5.31 C5.A | C5.A 42.39,5.95 42.39,3.97 41.91,3.49 38.1,3.49 38.05,3.54 | C6.1 38.32,8.86 40.25,8.89 | 40.25,9.05 40.25,8.89 | 40.25,8.89 40.25,8.25 C5.A | 38.05,3.54 37.94,3.65 v37.62,4.29 | 38.05,3.54 37.67,4.26 v37.62,4.29 | 38.05,3.54 37.76,4.2 v37.62,4.29
  Bottom 0.305: Q1.2 39.01,5.19
  Bottom 0.61: v37.62,4.29 37.94,5.04 | 37.94,5.04 37.94,5.08 38.1,5.24 39,5.24 Q1.2 | 37.75,4.34 | 37.75,4.34 | 37.75,4.34 | v37.62,4.29 37.75,4.34 | 37.82,4.34 | 37.66,4.18 37.82,4.34 | 37.94,5.04 37.66,4.18 | 37.94,5.04 37.75,4.34 | 37.75,4.34 | 37.94,5.04 | 37.94,5.04 37.75,4.34 | 37.75,4.34 | v37.62,4.29 37.75,4.34 | 37.94,5.04 37.66,4.18 | 37.66,4.18 | v37.62,4.29 37.66,4.18 | 37.94,5.04 37.75,4.34 | v37.62,4.29 37.75,4.34 | 37.94,5.04 37.82,4.34 | 37.66,4.18 37.82,4.34 | 37.94,5.04 37.75,4.34 | v37.62,4.29 37.75,4.34 | 37.94,5.04 37.66,4.18 | v37.62,4.29 37.66,4.18
RESET  (via drill 0.5 pad 1.02)
  Top 0.254: 24.77,18.84 R2.1 24.69,19 25.15,19 | 25.15,19 C15.1 26.54,20.19 26.56,20.21 | 26.56,20.21 26.67,20.32 v27.3,20.32 | v27.3,20.32 28.05,20.32 | 28.05,20.32 | 28.05,20.32 31.09,20.32 RESET.P$2 | 25.15,19 24.64,18.49 24.64,17.78 24.13,17.27 22.61,17.27 20.32,14.99 20.32,11.81 19.54,11.03 | v18.8,10.92 19.43,10.92 19.54,11.03 | 19.54,11.03 18.94,11.27 v18.8,10.92 | 19.54,11.03 19.04,10.62 v18.8,10.92 | 28.05,20.32 27.5,20.65 | v27.3,20.32 27.5,20.65 | 28.05,20.32 | 28.05,20.32 27.5,19.99 | v27.3,20.32 27.5,19.99 | 26.56,20.21 27.16,19.97 v27.3,20.32 | 26.56,20.21 27.07,20.62 v27.3,20.32 | 28.05,20.32 27.5,20.65 | 28.05,20.32 27.5,19.99 | 28.05,20.32 27.5,20.65 | v27.3,20.32 27.5,20.65 | 28.05,20.32 27.5,19.99 | v27.3,20.32 27.5,19.99
  Bottom 0.254: U2.4 19.98,9.74 19.33,10.39 | 19.33,10.39 v18.8,10.92 | C3.2 40.16,21.43 39.37,22.23 | 39.37,22.23 39.24,22.35 37.72,22.35 37.47,22.61 30.73,22.61 28.45,20.32 28.05,20.32 | PORT1.16 39.37,23.11 39.37,22.23 | v27.3,20.32 28.05,20.32 | 28.05,20.32 | 19.33,10.39 19.16,11.02 v18.8,10.92 | 19.33,10.39 18.7,10.55 v18.8,10.92 | 28.05,20.32 27.5,20.65 | v27.3,20.32 27.5,20.65 | 28.05,20.32 | 28.05,20.32 27.5,19.99 | v27.3,20.32 27.5,19.99 | 28.05,20.32 27.5,20.65 | 28.05,20.32 27.5,19.99 | 28.05,20.32 27.5,20.65 | v27.3,20.32 27.5,20.65 | 28.05,20.32 27.5,19.99 | v27.3,20.32 27.5,19.99
  Bottom 0.508: 39.37,23.11 39.88,23.67 PORT1.16 38.86,23.67 39.37,23.11
RXD2
  Bottom 0.254: U2.11 16.02,5.7 16.14,5.7 17.14,4.7 17.53,4.7 18.8,3.43 20.32,3.43 20.95,2.79 22.61,2.79 23.41,1.99 PORT2.10
  Bottom 0.508: 23.41,1.99 23.45,1.24 PORT2.10 24.16,1.96 23.41,1.99
SCK  (via drill 0.5 pad 1.02)
  Top 0.254: v28.07,5.46 28.07,4.95 28.28,4.74 | 28.28,4.74 29.21,3.81 29.21,2.29 PORT2.12 | 28.28,4.74 28.39,5.41 v28.07,5.46 | 28.28,4.74 27.82,5.24 v28.07,5.46 | 28.28,4.74 | 28.28,4.74 28.44,5.37 | 28.44,5.37 | v28.07,5.46 28.44,5.37 | 28.28,4.74 27.81,5.18 | v28.07,5.46 27.81,5.18 | 28.28,4.74 28.44,5.37 | v28.07,5.46 28.44,5.37 | 28.28,4.74 27.81,5.18 | v28.07,5.46 27.81,5.18
  Top 0.508: 29.21,2.29 28.7,1.73 PORT2.12 29.72,1.73 29.21,2.29
  Bottom 0.254: NRF.5 28.29,12.22 28.7,11.82 29.08,11.43 29.08,8.38 | 29.08,8.38 29.08,6.35 28.66,5.92 | U2.3 20.57,10.29 21.34,9.53 23.5,9.53 24.64,8.38 29.08,8.38 | v28.07,5.46 28.19,5.46 28.66,5.92 | 28.66,5.92 28,5.78 v28.07,5.46 | 28.66,5.92 28.36,5.32 v28.07,5.46 | 28.66,5.92 28.02,5.84 v28.07,5.46 | 28.66,5.92 28.42,5.32 v28.07,5.46
  Bottom 0.508: 28.7,11.82 28.35,12.51 NRF.5 27.95,11.61 28.7,11.82
SW1
  Bottom 0.61: Q1.3 41.26,3.35 41.91,2.54 41.91,2.29 | 41.91,2.29 PORT2.17 | 41.91,2.29 41.41,1.67 PORT2.17 | 41.91,2.29 42.41,1.67 PORT2.17
TXD2
  Bottom 0.254: U2.12 13.47,5.71 15.11,4.06 17.27,4.06 18.54,2.79 20.07,2.79 20.87,1.99 PORT2.9
  Bottom 0.508: 20.87,1.99 20.91,1.24 PORT2.9 21.62,1.96 20.87,1.99
VBUS  (via drill 0.5 pad 1.02)
  Top 0.406: USB.VBUS 44.42,11.4 44.29,11.27 43.34,11.27 43.34,10.09 D1.A
  Top 0.61: D1.A 43.14,10 | 43.14,10 | 43.14,10 v42.39,10 | v42.39,8.89 42.39,9.25 | 42.39,9.25 | 42.39,9.25 42.39,9.64 | 42.39,9.64 | 42.39,9.64 v42.39,10 | 43.14,10 42.44,10.2 | 42.39,9.25 42.49,9.63 | 43.14,10 42.44,10.2 | 42.44,10.2 | 42.44,10.2 | 43.14,10 42.44,9.81 | 42.44,9.81 | v42.39,10 42.44,9.81 | 42.44,10.2 | 42.44,9.81 | v42.39,10 42.44,9.81 | 42.39,9.25 42.58,9.95 | 42.58,9.95 | 42.58,9.95 | 42.39,9.25 42.28,9.63 | 42.19,9.95 | v42.39,10 42.19,9.95 | 42.58,9.95 | 42.19,9.95 | v42.39,10 42.19,9.95 | 42.39,9.64 42.49,9.26 | 42.49,9.63 42.33,9.25 | 42.33,9.25 42.2,8.97 | 42.28,9.63 42.19,8.92 | 42.28,9.63 42.45,9.25 | 42.45,9.25 42.57,8.97 | 42.39,9.64 42.28,9.26 | 42.28,9.26 42.19,8.95 | 42.19,8.95 | 42.19,8.95 | 42.39,9.64 42.49,9.26 | 42.49,9.26 42.58,8.95 | 42.39,9.64 42.28,9.26 | 42.28,9.26 42.19,8.95 | 42.19,8.95 | v42.39,8.89 42.19,8.95 | 42.39,9.64 42.58,8.95 | 42.58,8.95 | 42.58,8.95 | 43.14,10 42.44,10.2 | 42.39,9.25 42.49,9.63 | 42.44,10.2 | 42.58,9.95 | 43.14,10 42.44,10.2 | v42.39,10 42.44,10.2 | 43.14,10 | 43.14,10 42.44,9.81 | 42.44,9.81 | 43.14,10 42.44,10.2 | v42.39,10 42.44,10.2 | 43.14,10 42.44,9.81 | v42.39,10 42.44,9.81 | 43.14,10 42.44,10.2 | v42.39,10 42.44,10.2 | 43.14,10 42.44,9.81 | v42.39,10 42.44,9.81 | 42.49,9.63 42.58,9.95 | v42.39,10 42.58,9.95 | 42.39,9.25 | 42.28,9.63 42.19,9.95 | 42.19,9.95 | 42.39,9.25 42.58,9.95 | v42.39,10 42.58,9.95 | 42.39,9.25 42.28,9.63 | 42.28,9.63 42.19,9.95 | v42.39,10 42.19,9.95 | 42.39,9.25 42.49,9.63 | 42.49,9.63 42.58,9.95 | v42.39,10 42.58,9.95 | 42.39,9.25 42.28,9.63 | 42.28,9.63 42.19,9.95 | v42.39,10 42.19,9.95 | 42.49,9.26 42.54,9.62 | 42.33,9.25 42.58,9.93 v42.39,10 | 42.33,9.25 42.19,9.96 v42.39,10 | v42.39,10 42.59,9.99 42.54,9.27 42.21,9.91 v42.39,10
  Top 0.61: v42.39,10 42.57,9.91 42.23,9.27 42.18,9.99 v42.39,10 | 42.45,9.25 42.59,9.96 v42.39,10 | 42.45,9.25 42.2,9.93 v42.39,10 | 42.28,9.26 42.45,9.64 | 42.28,9.26 42.23,9.62 | 42.19,9.97 | v42.39,10 42.19,9.97 | 42.49,9.26 42.54,9.62 | 42.54,9.62 42.59,9.97 | v42.39,10 42.59,9.97 | 42.49,9.26 42.33,9.64 | 42.33,9.64 42.2,9.92 | 42.2,9.92 | v42.39,10 42.2,9.92 | 42.28,9.26 42.45,9.64 | 42.45,9.64 42.57,9.92 v42.39,10 | 42.28,9.26 42.23,9.62 | 42.23,9.62 42.19,9.97 | v42.39,10 42.19,9.97 | 42.49,9.26 42.59,9.97 | v42.39,10 42.59,9.97 | 42.49,9.26 42.2,9.92 | v42.39,10 42.2,9.92 | 42.39,9.64 42.58,8.95 | 42.2,8.97 | 42.49,9.63 42.2,8.97 | v42.39,8.89 42.2,8.97 | 42.49,9.63 42.59,8.92 | 42.59,8.92 | 42.28,9.63 42.19,8.92 | v42.39,8.89 42.19,8.92 | 42.28,9.63 42.57,8.97 | 42.45,9.64 42.2,8.96 v42.39,8.89 | 42.45,9.64 42.59,8.93 v42.39,8.89 | 42.23,9.62 42.18,8.9 v42.39,8.89 | 42.23,9.62 42.57,8.98 v42.39,8.89 | 42.54,9.62 42.21,8.98 v42.39,8.89 | 42.54,9.62 42.59,8.9 v42.39,8.89 | 42.33,9.64 42.19,8.93 v42.39,8.89 | 42.33,9.64 42.58,8.96 v42.39,8.89 | 42.39,9.64 42.19,8.95 | 42.19,8.95 | 42.39,9.64 | 42.49,9.63 42.2,8.97 | v42.39,8.89 42.2,8.97 | 42.49,9.63 42.59,8.92 | v42.39,8.89 42.59,8.92 | 42.28,9.63 42.19,8.92 | v42.39,8.89 42.19,8.92 | 42.28,9.63 42.57,8.97 | v42.39,8.89 42.57,8.97 | 42.39,9.64 42.19,8.95 | 42.19,8.95 | v42.39,8.89 42.19,8.95 | 42.39,9.64 42.58,8.95 | 42.58,8.95 | v42.39,8.89 42.58,8.95 | 42.39,9.64 42.19,8.95 | v42.39,8.89 42.19,8.95 | 42.39,9.64 42.58,8.95 | 42.58,8.95 | 42.39,9.64 42.19,8.95 | v42.39,8.89 42.19,8.95 | 42.39,9.64 42.58,8.95 | v42.39,8.89 42.58,8.95
  Bottom 0.305: U1.7 U1.8 37.7,9.78 C2.2 | 37.47,9.55 C2.2 | v42.39,8.89 42.39,8.14 | 42.39,8.14 42.39,6.67 41.27,5.56 40.48,5.56 40.01,5.08 40.01,3.65 39.69,3.33 39.01,3.33 Q1.1 39,3.33 36.99,3.33 36.67,3.65 36.67,4.92 37.47,5.71 37.47,6.8 R7.2 C2.2 | 42.39,9.25 42.7,9.83 | 42.39,9.25 42.58,9.61 | 42.39,9.25 42.19,9.61 | 42.19,9.61 42.07,9.83 | 42.7,9.83 | 42.07,9.83 | 42.58,9.61 42.13,9.13 | v42.39,8.89 42.13,9.13 | 42.58,9.61 42.66,9.3 | 42.66,9.3 42.73,8.97 | 42.73,8.97 | 42.19,9.61 42.12,9.3 | 42.12,9.3 42.04,8.97 | 42.58,9.61 42.7,9.83 | 42.39,9.25 42.7,9.83 | v42.39,10 42.7,9.83 | 42.39,9.25 | 42.39,9.25 42.19,9.61 | 42.19,9.61 42.07,9.83 | v42.39,10 42.07,9.83 | 42.39,9.25 42.58,9.61 | 42.58,9.61 42.7,9.83 | v42.39,10 42.7,9.83 | 42.39,9.25 42.19,9.61 | 42.19,9.61 42.07,9.83 | v42.39,10 42.07,9.83 | v42.39,10 42.66,9.78 42.25,9.26 42.05,9.89 v42.39,10 | 42.66,9.3 42.74,9.96 v42.39,10 | 42.66,9.3 42.15,9.73 v42.39,10 | 42.12,9.3 42.62,9.73 v42.39,10 | 42.12,9.3 42.03,9.96 v42.39,10 | v42.39,10 42.73,9.89 42.52,9.26 42.11,9.78 v42.39,10 | 42.39,8.14 42.7,8.72 | v42.39,8.89 42.7,8.72 | 42.39,8.14 42.07,8.72 | v42.39,8.89 42.07,8.72 | 42.19,9.61 42.04,8.97 | 42.19,9.61 42.65,9.13 | 42.39,8.14 42.7,8.72 | 42.39,8.14 42.07,8.72 | 42.39,8.14 42.7,8.72 | v42.39,8.89 42.7,8.72 | 42.39,8.14 42.07,8.72 | v42.39,8.89 42.07,8.72 | 42.58,9.61 42.13,9.13 | v42.39,8.89 42.13,9.13 | 42.58,9.61 42.73,8.97 | v42.39,8.89 42.73,8.97 | 42.19,9.61 42.04,8.97 | v42.39,8.89 42.04,8.97 | 42.19,9.61 42.65,9.13 | v42.39,8.89 42.65,9.13
  Bottom 0.61: PORT2.15 37.85,1.27 | 37.85,1.27 38.35,1.27 | 38.35,1.27 PORT2.16 | v42.39,10 42.39,9.64 | 42.39,9.64 | 42.39,9.64 42.39,9.25 | 42.39,9.25 | 42.39,9.25 v42.39,8.89 | v42.39,8.89 42.55,8.89 42.7,8.73 43.12,8.73 | 43.12,8.73 43.47,8.73 U4.4 | PORT2.16 39.37,2.22 39.31,2.28 | 39.31,2.28 39.05,2.54 39.05,3.29 Q1.1 | 42.39,9.25 42.49,9.63 | 42.39,9.25 42.58,9.95 | 42.58,9.95 | 42.58,9.95 | 42.39,9.25 42.28,9.63 | 42.19,9.95 | v42.39,10 42.19,9.95 | 42.58,9.95 | 42.19,9.95 | v42.39,10 42.19,9.95 | 42.39,9.64 42.49,9.26 | 42.49,9.63 42.33,9.25 | 42.33,9.25 42.2,8.97 | 42.28,9.63 42.19,8.92 | 42.28,9.63 42.45,9.25 | 42.45,9.25 42.57,8.97 | 42.39,9.64 42.28,9.26 | 42.28,9.26 42.19,8.95 | 42.19,8.95 | 42.19,8.95 | 42.39,9.64 42.49,9.26 | 42.49,9.26 42.58,8.95 | 42.39,9.64 42.28,9.26 | 42.28,9.26 42.19,8.95 | 42.19,8.95 | v42.39,8.89 42.19,8.95 | 42.39,9.64 42.58,8.95 | 42.58,8.95 | 42.58,8.95 | 42.39,9.25 42.49,9.63 | 42.58,9.95 | 42.49,9.63 42.58,9.95 | v42.39,10 42.58,9.95 | 42.39,9.25 | 42.28,9.63 42.19,9.95 | 42.19,9.95 | 42.39,9.25 42.58,9.95 | v42.39,10 42.58,9.95 | 42.39,9.25 42.28,9.63 | 42.28,9.63 42.19,9.95 | v42.39,10 42.19,9.95 | 42.39,9.25 42.49,9.63 | 42.49,9.63 42.58,9.95 | v42.39,10 42.58,9.95 | 42.39,9.25 42.28,9.63 | 42.28,9.63 42.19,9.95 | v42.39,10 42.19,9.95 | 42.49,9.26 42.54,9.62 | 42.33,9.25 42.58,9.93 v42.39,10 | 42.33,9.25 42.19,9.96 v42.39,10 | v42.39,10 42.59,9.99 42.54,9.27 42.21,9.91 v42.39,10 | v42.39,10 42.57,9.91 42.23,9.27 42.18,9.99 v42.39,10 | 42.45,9.25 42.59,9.96 v42.39,10 | 42.45,9.25 42.2,9.93 v42.39,10 | 42.28,9.26 42.45,9.64 | 42.28,9.26 42.23,9.62 | 42.19,9.97 | v42.39,10 42.19,9.97 | 42.49,9.26 42.54,9.62 | 42.54,9.62 42.59,9.97 | v42.39,10 42.59,9.97 | 42.49,9.26 42.33,9.64
  Bottom 0.61: 42.33,9.64 42.2,9.92 | 42.2,9.92 | v42.39,10 42.2,9.92 | 42.28,9.26 42.45,9.64 | 42.45,9.64 42.57,9.92 v42.39,10 | 42.28,9.26 42.23,9.62 | 42.23,9.62 42.19,9.97 | v42.39,10 42.19,9.97 | 42.49,9.26 42.59,9.97 | v42.39,10 42.59,9.97 | 42.49,9.26 42.2,9.92 | v42.39,10 42.2,9.92 | 42.39,9.64 42.58,8.95 | 42.2,8.97 | 42.49,9.63 42.2,8.97 | v42.39,8.89 42.2,8.97 | 42.49,9.63 42.59,8.92 | 42.59,8.92 | 42.28,9.63 42.19,8.92 | v42.39,8.89 42.19,8.92 | 42.28,9.63 42.57,8.97 | 42.45,9.64 42.2,8.96 v42.39,8.89 | 42.45,9.64 42.59,8.93 v42.39,8.89 | 42.23,9.62 42.18,8.9 v42.39,8.89 | 42.23,9.62 42.57,8.98 v42.39,8.89 | 42.54,9.62 42.21,8.98 v42.39,8.89 | 42.54,9.62 42.59,8.9 v42.39,8.89 | 42.33,9.64 42.19,8.93 v42.39,8.89 | 42.33,9.64 42.58,8.96 v42.39,8.89 | 42.39,9.64 42.19,8.95 | 42.19,8.95 | 42.39,9.64 | 42.49,9.63 42.2,8.97 | v42.39,8.89 42.2,8.97 | 42.49,9.63 42.59,8.92 | v42.39,8.89 42.59,8.92 | 42.28,9.63 42.19,8.92 | v42.39,8.89 42.19,8.92 | 42.28,9.63 42.57,8.97 | v42.39,8.89 42.57,8.97 | 42.39,9.64 42.19,8.95 | 42.19,8.95 | v42.39,8.89 42.19,8.95 | 42.39,9.64 42.58,8.95 | 42.58,8.95 | v42.39,8.89 42.58,8.95 | 42.39,9.64 42.19,8.95 | v42.39,8.89 42.19,8.95 | 42.39,9.64 42.58,8.95 | 42.58,8.95 | 42.39,9.64 42.19,8.95 | v42.39,8.89 42.19,8.95 | 42.39,9.64 42.58,8.95 | v42.39,8.89 42.58,8.95 | 43.12,8.73 42.48,9.07 v42.39,8.89 | 43.12,8.73 42.4,8.69 v42.39,8.89 | 38.35,1.27 38.97,0.77 PORT2.16 | 38.35,1.27 38.97,1.77 PORT2.16 | 39.31,2.28 38.85,1.64 PORT2.16 | 39.31,2.28 39.84,1.7 PORT2.16 | 37.85,1.27 37.23,1.77 PORT2.15 | 37.85,1.27 37.23,0.77 PORT2.15
  pour Top (isolate 0.406): 46.83,11.75 42.39,11.75 41.75,11.11 41.75,8.41 42.23,8.1 43.97,8.1 44.61,8.73 44.61,10.48 45.09,10.95 46.67,10.95 46.83,11.11
VDD
  Bottom 0.305: U1.6 39.58,12.97 40.16,12.38 C1.2

### Text on the board
tNames: 21 | 1
bNames: C4 | C5 | C6 | C7 | A7 | A6 | A5 | A4 | A3 | A2 | A1 | A0 | CP_RX | CP_TX | MISO | RST | GND | GND | GND | SMART RF | V.25.06.15.PS | C3 | C2 | C1 | C0 | D7 | D6 | D5 | D4 | TX2 | RX2 | 3.3V | SCK | MOSI | GND | 5V | S2 | S1 | BAT+ | BAT-